# EAGLE design C-Gleis-Weichenbeleuchtung_Jw_016_01_07 (EAGLE 5.10)
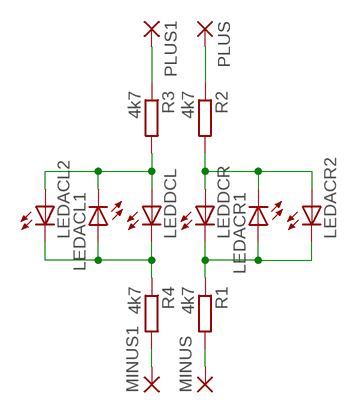
[diagram p0: schematic, sheet 1]

## Parts
LEDACL1  LEDCHIPLED_1206  [CHIPLED_1206]
LEDACL2  LEDCHIPLED_1206  [CHIPLED_1206]
LEDACR1  LEDCHIPLED_1206  [CHIPLED_1206]
LEDACR2  LEDCHIPLED_1206  [CHIPLED_1206]
LEDDCL  LEDCHIPLED_1206  [CHIPLED_1206]
LEDDCR  LEDCHIPLED_1206  [CHIPLED_1206]
MINUS  SMD2  [SMD1,27-2,54]
MINUS1  SMD2  [SMD1,27-2,54]
PLUS  SMD2  [SMD1,27-2,54]
PLUS1  SMD2  [SMD1,27-2,54]
R1  4k7  R-EU_R0603S  [R0603S]
R2  4k7  R-EU_R0603S  [R0603S]
R3  4k7  R-EU_R0603S  [R0603S]
R4  4k7  R-EU_R0603S  [R0603S]

## Nets
N$1: MINUS.1(P) R1.2
N$2: LEDACL1.C LEDACL2.A LEDDCL.A R3.2
N$3: LEDACR1.A LEDACR2.C LEDDCR.C R1.1
N$4: LEDACR1.C LEDACR2.A LEDDCR.A R2.2
N$5: PLUS.1(P) R2.1
N$6: LEDACL1.A LEDACL2.C LEDDCL.C R4.1
N$7: PLUS1.1(P) R3.1
N$8: MINUS1.1(P) R4.2

## Library data of the parts
LEDACL1 LEDACL2 LEDACR1 LEDACR2 LEDDCL LEDDCR = led:LED: LED OSRAM: - CHIPLED LG R971, LG N971, LY N971, LG Q971, LY Q971, LO R971, LY R971 LH N974, LH R974 LS Q976, LO Q976, LY Q976 LO Q996 - Hyper CHIPLED LW Q18S LB Q993, LB Q99A, LB R99A - SideLED LS A670, LO A670, LY A670, LG A670, LP A670 LB A673, LV A673, LT A673, LW A673 LH A674 LY A675 LS A676, LA A676, LO A676, LY A676, LW A676 LS A679, LY A679, LG A679 - Hyper Micro SIDELED® LS Y876, LA Y876, LO Y876, LY Y876 LT Y87S - SmartLED LW L88C, LW L88S LB L89C, LB L89S, LG L890 LS L89K, LO L89K, LY L89K LS L896, LA L896, LO L896, LY L896 - TOPLED LS T670, LO T670, LY T670, LG T670, LP T670 LSG T670, LSP T670, LSY T670, LOP T670, LYG T670 LG T671, LOG T671, LSG T671 LB T673, LV T673, LT T673, LW T673 LH T674 LS T676, LA T676, LO T676, LY T676, LB T676, LH T676, LSB T676, LW T676 LB T67C, LV T67C, LT T67C, LS T67K, LO T67K, LY T67K, LW E67C LS E67B, LA E67B, LO E67B, LY E67B, LB E67C, LV E67C, LT E67C LW T67C LS T679, LY T679, LG T679 LS T770, LO T770, LY T770, LG T770, LP T770 LB T773, LV T773, LT T773, LW T773 LH T774 LS E675, LA E675, LY E675, LS T675 LS T776, LA T776, LO T776, LY T776, LB T776 LHGB T686 LT T68C, LB T68C - Hyper Mini TOPLED® LB M676 - Mini TOPLED Santana® LG M470 LS M47K, LO M47K, LY M47K Source: http://www.osram.convergy.de LUXEON: - LUMILED® LXK2-PW12-R00, LXK2-PW12-S00, LXK2-PW14-U00, LXK2-PW14-V00 LXK2-PM12-R00, LXK2-PM12-S00, LXK2-PM14-U00 LXK2-PE12-Q00, LXK2-PE12-R00, LXK2-PE12-S00, LXK2-PE14-T00, LXK2-PE14-U00 LXK2-PB12-K00, LXK2-PB12-L00, LXK2-PB12-M00, LXK2-PB14-N00, LXK2-PB14-P00, LXK2-PB14-Q00 LXK2-PR12-L00, LXK2-PR12-M00, LXK2-PR14-Q00, LXK2-PR14-R00 LXK2-PD12-Q00, LXK2-PD12-R00, LXK2-PD12-S00 LXK2-PH12-R00, LXK2-PH12-S00 LXK2-PL12-P00, LXK2-PL12-Q00, LXK2-PL12-R00 Source: www.luxeon.com KINGBRIGHT: KA-3528ASYC Source: www.kingbright.com
MINUS MINUS1 PLUS PLUS1 = wirepad:SMD2: SMD PAD
R1-R4 = rcl:R-EU_: RESISTOR, European symbol

## Board
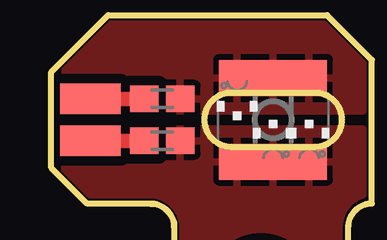
[diagram p1: board, top side]
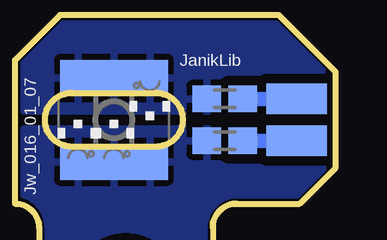
[diagram p2: board, bottom side, seen from below]

No outline drawn. Coordinates in mm, seen from the top.
Copper layers (1*16): Top 0.035mm / dielectric 1.5mm / Bottom 0.035mm
Design rules "default *": minimum track width 7mil, minimum drill 0.6mm, track to track 8mil, track to pad 8mil, pad to pad 8mil, via to via 8mil, smd to smd 8mil, copper to edge 40mil, drill to drill 8mil, minimum pad ring 10mil, minimum via ring 8mil, stop-mask expansion 4mil, vias tented up to drill 0mil, thermal gap 10mil
Holes 2.5 mm at 8.75,3.25
Milling: 24 lines

### Footprints (pad centres in the part's own frame; a part is rotated, then mirrored left to right if it is on the bottom)
CHIPLED_1206 = smd 1.5 x 1.5: A 0,-1.75; C 0,1.75
SMD1,27-2,54 = smd 1.27 x 2.54: 1 0,0
R0603S = smd 1.2 x 1.1: 1 -0.75,0; 2 0.75,0

### Placement (x,y rotation side)
LEDACL1  7.75,10.25 0 bottom
LEDACL2  9.25,10.25 180 bottom
LEDACR1  7.75,10.25 0 top
LEDACR2  9.25,10.25 180 top
LEDDCL  10.75,10.25 180 bottom
LEDDCR  10.75,10.25 180 top
MINUS  1.62,9.38 90 top
MINUS1  1.62,9.38 270 bottom
PLUS  1.62,11.12 270 top
PLUS1  1.62,11.12 270 bottom
R1  4.62,9.38 180 top
R2  4.62,11.12 0 top
R3  4.62,11.12 180 bottom
R4  4.62,9.38 0 bottom

### Tracks (layer width: path | path; a pad name or v marks a point on that pad's centre or on a via)
N$1
  Top 0.61: MINUS.1 R1.2
N$2
  pour Bottom (isolate 0.406): 11.38,14.25 2.5,14.25 0.38,12.12 0.38,10.62 13,10.62 13,12.62
N$3
  pour Top (isolate 0.406): 0.38,9.88 13,9.88 13,7.12 arc72 12,5.75 12,3.3 9.38,0.68 8.12,0.68 5.5,3.3 5.5,5.75 arc90 4,7.12 1.62,7.12 0.38,8.38
N$4
  pour Top (isolate 0.406): 2.5,14.25 11.38,14.25 13,12.62 13,10.62 0.38,10.62 0.38,12.12
N$5
  Top 0.61: PLUS.1 R2.1
N$6
  pour Bottom (isolate 0.406): 0.38,9.88 13,9.88 13,7.12 arc72 12,5.75 12,3.3 9.38,0.68 8.12,0.68 5.5,3.3 5.5,5.75 arc90 4,7.12 1.62,7.12 0.38,8.38
N$7
  Bottom 0.61: PLUS1.1 R3.1
N$8
  Bottom 0.61: MINUS1.1 R4.2

### Text on the board
bNames: JanikLib | Jw_016_01_07
tStop: design by Janik Merz | + | C-Gleis Weiche | Rechts
bStop: design by Janik Merz | + | - | C-Gleis Weiche | Links
Document: 1206 LEDs kopfüber einlöten | Entweder 2 Stück antiparallel für AC | oder 1 Stück (mittig) für DC | Bei höheren Versorgungsspannungen | bitte zwei Widerstande (mit je halbem Wert) | benutzen um Verlustleistung zu verteilen | Empfehlung: 5V, dann reicht ein Widerstand